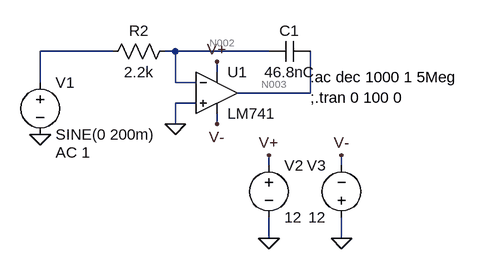
[diagram p0: schematic Integratore RC.asc]
Integratore RC.asc, the LTspice schematic file:
Version 4.1
SHEET 1 880 680
WIRE 144 96 32 96
WIRE 240 96 224 96
WIRE 384 96 240 96
WIRE 304 128 304 112
WIRE 32 144 32 96
WIRE 240 144 240 96
WIRE 272 144 240 144
WIRE 448 160 448 96
WIRE 448 160 336 160
WIRE 272 176 240 176
WIRE 240 208 240 176
WIRE 304 208 304 192
WIRE 384 272 384 256
WIRE 496 272 496 256
WIRE 384 384 384 352
WIRE 496 384 496 352
FLAG 240 208 0
FLAG 304 112 V+
FLAG 304 208 V-
FLAG 384 256 V+
FLAG 32 224 0
FLAG 384 384 0
FLAG 496 256 V-
FLAG 496 384 0
SYMBOL OpAmps\\LM741 304 96 R0
SYMATTR InstName U1
SYMBOL voltage 32 128 R0
WINDOW 123 24 124 Left 2
WINDOW 39 0 0 Left 0
SYMATTR Value2 AC 1
SYMATTR InstName V1
SYMATTR Value SINE(0 200m)
SYMBOL res 240 80 R90
WINDOW 0 0 56 VBottom 2
WINDOW 3 32 56 VTop 2
SYMATTR InstName R2
SYMATTR Value 2.2k
SYMBOL voltage 384 256 R0
WINDOW 123 0 0 Left 0
WINDOW 39 0 0 Left 0
SYMATTR InstName V2
SYMATTR Value 12
SYMBOL voltage 496 368 R180
WINDOW 0 24 96 Left 2
WINDOW 3 24 16 Left 2
WINDOW 123 0 0 Left 0
WINDOW 39 0 0 Left 0
SYMATTR InstName V3
SYMATTR Value 12
SYMBOL cap 448 80 R90
WINDOW 0 0 32 VBottom 2
WINDOW 3 32 32 VTop 2
SYMATTR InstName C1
SYMATTR Value 46.8nC
TEXT 448 136 Left 2 !.ac dec 1000 1 5Meg\n;.tran 0 100 0

The netlist it stands for:
* Integratore RC.asc
X§U1 0 N002 V+ V- N003 LM741  ; pins In+ In- V+ V- OUT
V1 N001 0 SINE(0 200m) AC 1
R2 N002 N001 2.2k
V2 V+ 0 12
V3 0 V- 12
C1 N003 N002 46.8nC
.ac dec 1000 1 5Meg
;.tran 0 100 0
.lib LM741.lib
.backanno
.end

* Results of the author's LTspice run, read from the files saved beside the schematic
* Operating Point, zero values left out:
*   V(v+) = 12 V
*   V(n003) = 10.93 V
*   V(n002) = -214.6 µV
*   V(v-) = -12 V
*   I(V1) = -97.56 nA
*   I(V3) = -1.626 mA
*   I(R2) = -97.56 nA
*   I(V2) = -1.626 mA
*   Ix(u1:1) = 62.17 nA
*   Ix(u1:2) = 97.56 nA
*   Ix(u1:99) = 1.626 mA
*   Ix(u1:50) = -1.626 mA
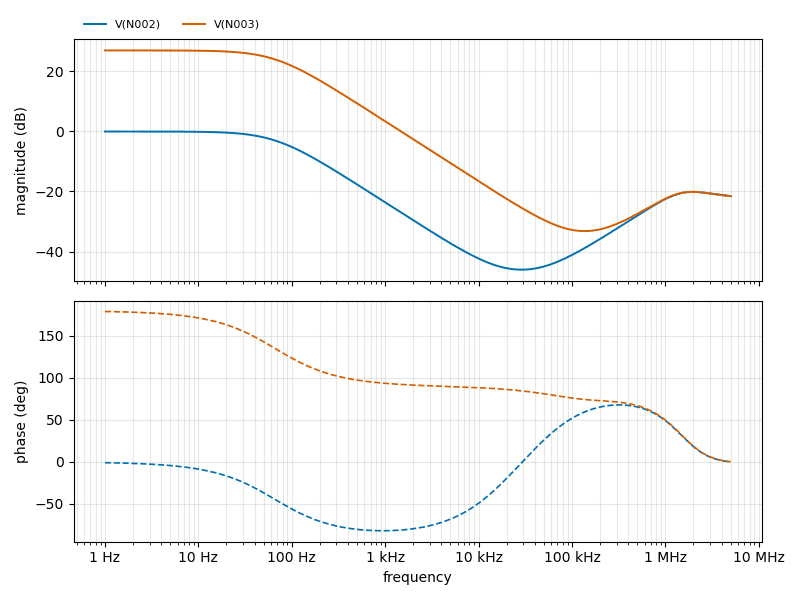
[diagram p1: AC Analysis of Integratore RC.asc, plotted from the saved traces]
* AC Analysis, 1 run:
*   V(N002): -0.07 dB at 1 Hz, -21.56 dB at 5 MHz, peak -0.07 dB at 1 Hz, 3 dB below the peak at 66.58 Hz
*   V(N003): 26.89 dB at 1 Hz, -21.56 dB at 5 MHz, peak 26.89 dB at 1 Hz, 3 dB below the peak at 66.58 Hz